# Altium schematic sheet Sensors.SchDoc
size A3; SheetNumber: 2; SheetTotal: 2
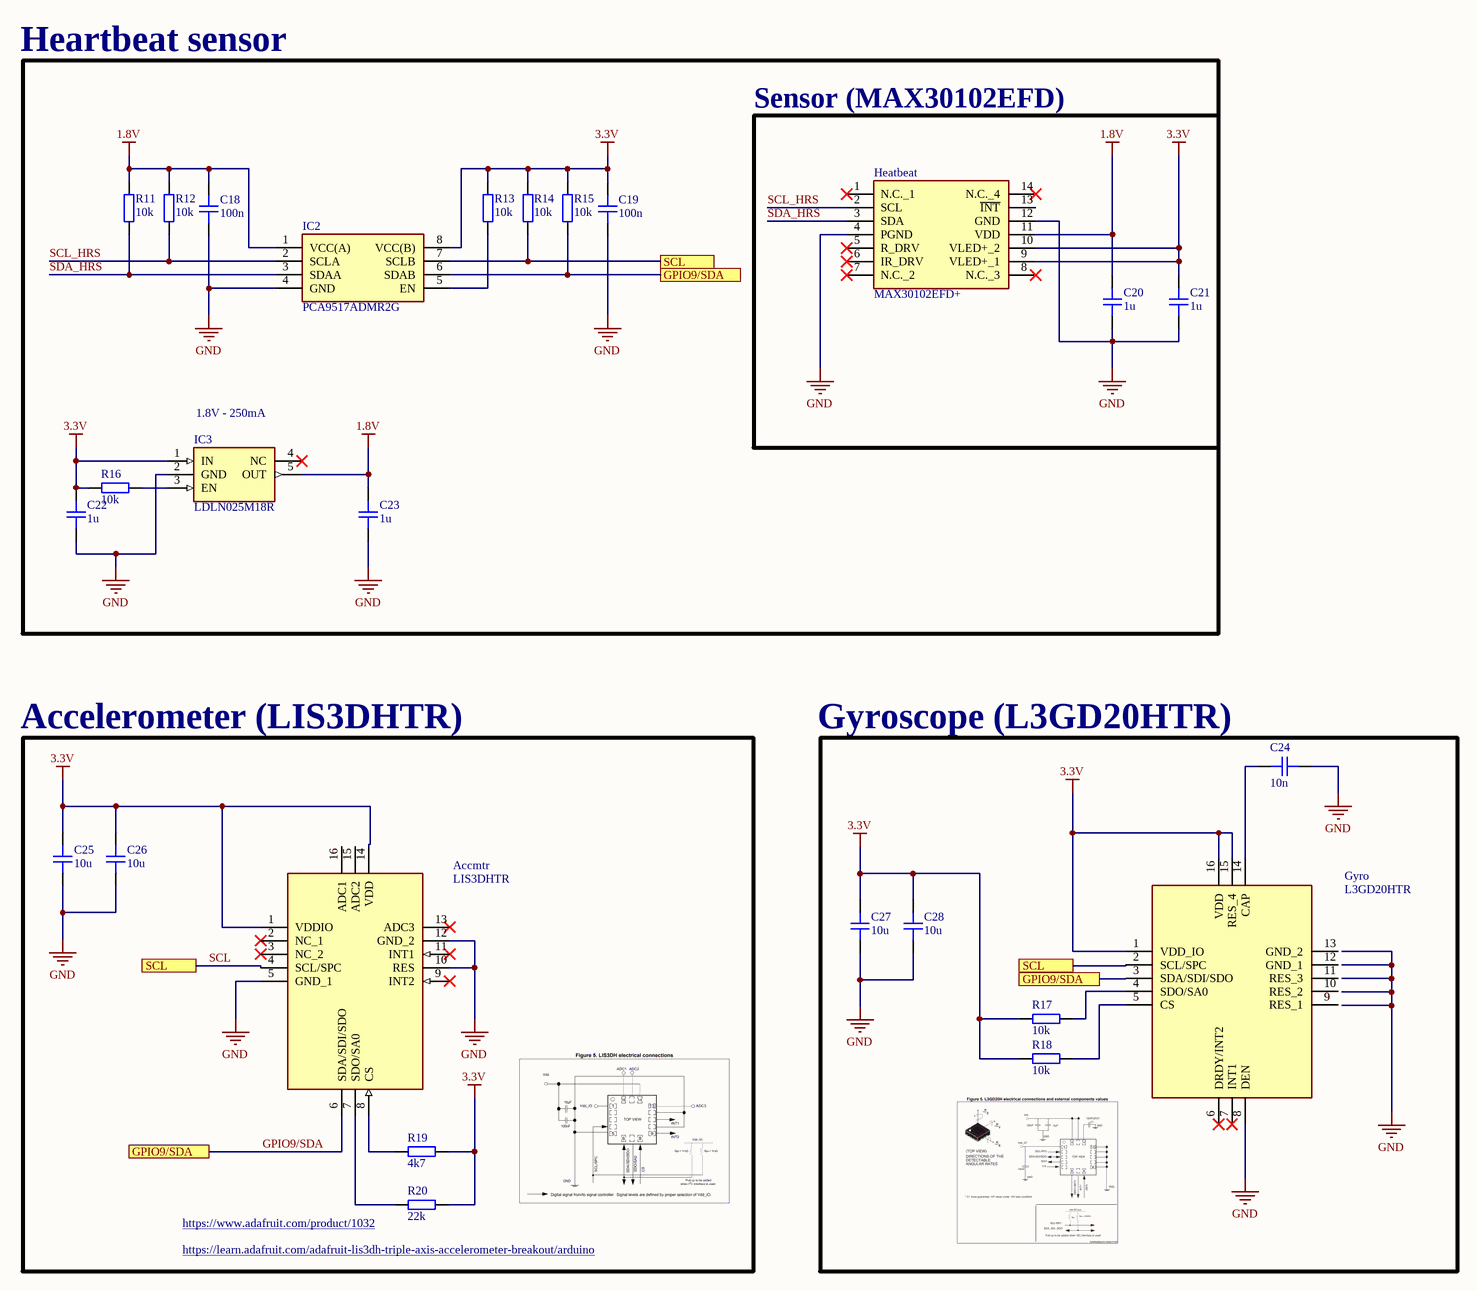
[diagram p0: Sensors.SchDoc]

## Parts
Accmtr  LIS3DHTR  [LIS3DHTR]
C18  100n  [CAP_1206]
C19  100n  [CAP_1206]
C20  1u  [CAP_1206]
C21  1u  [CAP_1206]
C22  1u  [CAP_1206]
C23  1u  [CAP_1206]
C24  10n  [CAP_1206]
C25  10u  [CAP_1206]
C26  10u  [CAP_1206]
C27  10u  [CAP_1206]
C28  10u  [CAP_1206]
Gyro  L3GD20HTR  [H3LIS100DLTR]
Heatbeat  MAX30102EFD+  [14-LEAD-OESIP]
IC2  PCA9517ADMR2G  [SOP65P490X110-8N]
IC3  LDLN025M18R  [SOT95P280X145-5N]
R11  10k  [RES_1206]
R12  10k  [RES_1206]
R13  10k  [RES_1206]
R14  10k  [RES_1206]
R15  10k  [RES_1206]
R16  10k  [RES_1206]
R17  10k  [RES_1206]
R18  10k  [RES_1206]
R19  4k7  [RES_1206]
R20  22k  [RES_1206]

## Blocks framed on the sheet
Heartbeat sensor: C18 C19 C22 C23 IC2 IC3 R11-R16
Sensor (MAX30102EFD): C20 C21 Heatbeat
Accelerometer (LIS3DHTR): Accmtr C25 C26 R19 R20
Gyroscope (L3GD20HTR): C24 C27 C28 Gyro R17 R18

## Ports
GPIO9/SDA (see IC_Schematic[5B], Sensors[2D], Sensors[4A]), GPIO9/SDA (see IC_Schematic[5B], Sensors[2D], Sensors[5C]), GPIO9/SDA (see IC_Schematic[5B], Sensors[4A], Sensors[5C]), SCL (see IC_Schematic[5B], Sensors[2C], Sensors[4A]), SCL (see IC_Schematic[5B], Sensors[2C], Sensors[5C]), SCL (see IC_Schematic[5B], Sensors[4A], Sensors[5C])

## Nets
1.8V: C18.2 C20.2 C23.2 Heatbeat.11(VDD) IC2.1(VCC(A)) IC3.5(OUT) R11.1 R12.1
3.3V: Accmtr.1(VDDIO) Accmtr.14(VDD) C19.2 C21.2 C22.2 C25.2 C26.2 C27.2 C28.2 Gyro.1(VDD_IO) Gyro.15(RES_4) Gyro.16(VDD) Heatbeat.9(VLED+_1) Heatbeat.10(VLED+_2) IC2.8(VCC(B)) IC3.1(IN) R13.1 R14.1 R15.1 R16.1 R17.2 R18.2 R19.1 R20.1
GND: Accmtr.5(GND_1) Accmtr.10(RES) Accmtr.12(GND_2) C18.1 C19.1 C20.1 C21.1 C22.1 C23.1 C24.2 C25.1 C26.1 C27.1 C28.1 Gyro.8(DEN) Heatbeat.4(PGND) Heatbeat.12(GND) IC2.4(GND) IC3.2(GND)
GPIO9/SDA: Accmtr.6(SDA/SDI/SDO) Gyro.3(SDA/SDI/SDO) IC2.6(SDAB) R15.2 ; port GPIO9/SDA
SCL: Accmtr.4(SCL/SPC) Gyro.2(SCL/SPC) IC2.7(SCLB) R14.2 ; port SCL
SCL_HRS: Heatbeat.2(SCL) IC2.2(SCLA) R12.2
SDA_HRS: Heatbeat.3(SDA) IC2.3(SDAA) R11.2
NetAccmtr_7: Accmtr.7(SDO/SA0) R20.2
NetAccmtr_8: Accmtr.8(CS) R19.2
NetC24_1: C24.1 Gyro.14(CAP)
NetGyro_4: Gyro.4(SDO/SA0) R17.1
NetGyro_5: Gyro.5(CS) R18.1
NetIC2_5: IC2.5(EN) R13.2
NetIC3_3: IC3.3(EN) R16.2

Not connected (* = marked no-connect by the designer): Accmtr 2(NC_1)* 3(NC_2)* 9(INT2)* 11(INT1)* 13(ADC3)* 15(ADC2) 16(ADC1); Gyro 6(DRDY/INT2)* 7(INT1)* 9(RES_1) 10(RES_2) 11(RES_3) 12(GND_1) 13(GND_2); Heatbeat 1(N.C._1)* 5(R_DRV)* 6(IR_DRV)* 7(N.C._2)* 8(N.C._3)* 13(~{INT}) 14(N.C._4)*; IC3 4(NC)*

## Notes on the sheet
- (near IC3) 1.8V - 250mA
- (near R20) https://www.adafruit.com/product/1032
- (near R20) https://learn.adafruit.com/adafruit-lis3dh-triple-axis-accelerometer-breakout/arduino

## Library data of the parts
Accmtr = LIS3DHTR: Accelerometer; Manufacturer_Name: STMicroelectronics; Datasheet Link: http://www.st.com/content/ccc/resource/technical/document/datasheet/3c/ae/50/85/d6/b1/46/fe/CD00274221.pdf/files/CD00274221.pdf/jcr:content/translations/en.CD00274221.pdf; Height: 1mm; Manufacturer_Part_Number: LIS3DHTR; Mouser Part Number: 511-LIS3DHTR; Mouser Price/Stock: https://www.mouser.co.uk/ProductDetail/STMicroelectronics/LIS3DHTR?qs=6la6oa3D8xzhXYax3cEo4w%3D%3D; Arrow Part Number: LIS3DHTR; Arrow Price/Stock: https://www.arrow.com/en/products/lis3dhtr/stmicroelectronics
C18-C23 = CAP_1206_16V: Capacitor SMD 1206 16V
C24-C28 = CAP_1206_50V: Capacitor SMD 1206 50V
Gyro = L3GD20HTR: MEMS motion sensor: / three-axis digital output gyroscope; Manufacturer_Name: STMicroelectronics; Datasheet Link: http://www.st.com/content/ccc/resource/technical/document/datasheet/35/b1/e0/39/71/57/43/01/DM00060659.pdf/files/DM00060659.pdf/jcr:content/translations/en.DM00060659.pdf; Height: 1mm; Manufacturer_Part_Number: L3GD20HTR; Mouser Part Number: 511-L3GD20HTR; Mouser Price/Stock: https://www.mouser.co.uk/ProductDetail/STMicroelectronics/L3GD20HTR?qs=7v3IMFVTeKNoM%2F2Sb4QSlQ%3D%3D; Arrow Part Number: L3GD20HTR; Arrow Price/Stock: https://www.arrow.com/en/products/l3gd20htr/stmicroelectronics
Heatbeat = MAX30102EFD+: Integrated Circuit; Manufacturer_Name: Analog Devices; Datasheet Link: https://datasheets.maximintegrated.com/en/ds/MAX30102.pdf; Manufacturer_Part_Number: MAX30102EFD+; Mouser Part Number: 700-MAX30102EFD+; Mouser Price/Stock: https://www.mouser.co.uk/ProductDetail/Maxim-Integrated/MAX30102EFD%2b?qs=nVS1qgv%252BQrk9UYEvS27V%2Fg%3D%3D
IC2 = PCA9517ADMR2G: Integrated Circuit; Manufacturer_Name: onsemi; Datasheet Link: https://www.arrow.com/en/products/pca9517admr2g/on-semiconductor; Height: 1.1mm; Manufacturer_Part_Number: PCA9517ADMR2G; Mouser Part Number: 863-PCA9517ADMR2G; Mouser Price/Stock: https://www.mouser.co.uk/ProductDetail/onsemi/PCA9517ADMR2G?qs=tCMd4XlZ%2FiBws0nQ3cmpKw%3D%3D; Arrow Part Number: PCA9517ADMR2G; Arrow Price/Stock: https://www.arrow.com/en/products/pca9517admr2g/on-semiconductor?region=nac
IC3 = LDLN025M18R: Integrated Circuit; Manufacturer_Name: STMicroelectronics; Datasheet Link: https://mouser.componentsearchengine.com/Datasheets/2/LDLN025M18R.pdf; Height: 1.45mm; Manufacturer_Part_Number: LDLN025M18R; Mouser Part Number: 511-LDLN025M18R; Mouser Price/Stock: https://www.mouser.co.uk/ProductDetail/STMicroelectronics/LDLN025M18R?qs=5aG0NVq1C4xLjfzI8y7cFQ%3D%3D; Arrow Part Number: LDLN025M18R; Arrow Price/Stock: https://www.arrow.com/en/products/ldln025m18r/stmicroelectronics
R11-R20 = RES_1206: Resistor SMD 1206